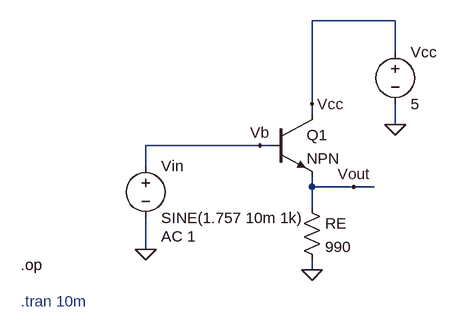
[diagram p0: schematic emitter_follower.asc]
emitter_follower.asc, the LTspice schematic file:
Version 4
SHEET 1 880 680
WIRE 448 -32 320 -32
WIRE 448 16 448 -32
WIRE 320 96 320 -32
WIRE 320 112 320 96
WIRE 448 128 448 96
WIRE 240 160 64 160
WIRE 256 160 240 160
WIRE 64 192 64 160
WIRE 320 224 320 208
WIRE 384 224 320 224
WIRE 416 224 384 224
WIRE 320 256 320 224
WIRE 64 320 64 272
WIRE 320 352 320 336
FLAG 64 320 0
FLAG 320 352 0
FLAG 448 128 0
FLAG 320 96 Vcc
FLAG 384 224 Vout
FLAG 240 160 Vb
SYMBOL res 304 240 R0
SYMATTR InstName RE
SYMATTR Value 990
SYMBOL voltage 448 0 R0
WINDOW 123 0 0 Left 0
WINDOW 39 0 0 Left 0
SYMATTR InstName Vcc
SYMATTR Value 5
SYMBOL npn 256 112 R0
SYMATTR InstName Q1
SYMBOL voltage 64 176 R0
WINDOW 123 24 124 Left 2
WINDOW 39 24 124 Left 2
SYMATTR Value2 AC 1
SYMATTR InstName Vin
SYMATTR Value SINE(1.757 10m 1k)
TEXT -128 344 Left 2 !.op
TEXT -128 400 Left 2 ;.tran 10m

The netlist it stands for:
* emitter_follower.asc
RE Vout 0 990
Vcc Vcc 0 5
Q1 Vcc Vb Vout 0 NPN
Vin Vb 0 SINE(1.757 10m 1k) AC 1
.model NPN NPN
.model PNP PNP
.lib standard.bjt
.op
* .tran 10m
.backanno
.end